# Altium schematic sheet V_9.SchDoc
size A4
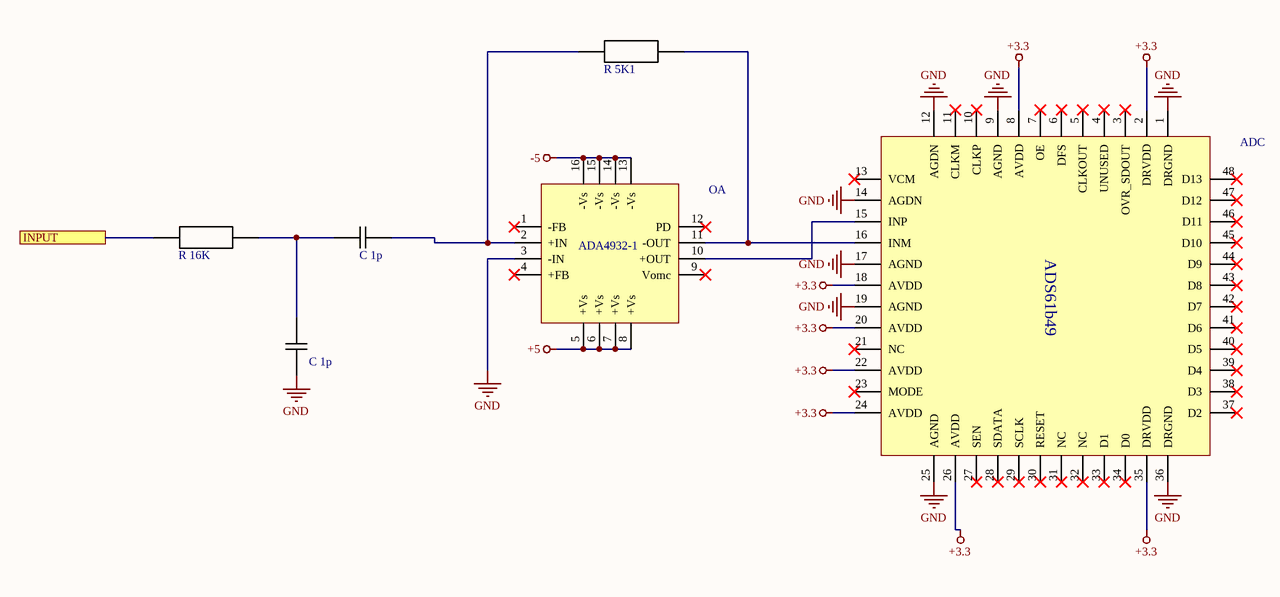
[diagram p0: V_9.SchDoc]

## Parts
1  ADC  [ADS61B49]
2  OA  [ADA4932-1]
3  R 16K  [R0805]
4  C 1p  [С0805]
8  C 1p  [С0805]
9  R 5K1  [R0805]

## Ports
INPUT

## Nets
+3.3: 1.2(DRVDD) 1.8(AVDD) 1.18(AVDD) 1.20(AVDD) 1.22(AVDD) 1.24(AVDD) 1.26(AVDD) 1.35(DRVDD)
+5: 2.5(+Vs) 2.6(+Vs) 2.7(+Vs) 2.8(+Vs)
-5: 2.13(-Vs) 2.14(-Vs) 2.15(-Vs) 2.16(-Vs)
GND: 1.1(DRGND) 1.9(AGND) 1.12(AGDN) 1.14(AGDN) 1.17(AGND) 1.19(AGND) 1.25(AGND) 1.36(DRGND) 2.3(-IN) 8.1
INPUT: 3.1 ; port INPUT
Net1_15: 1.15(INP) 2.10(+OUT)
Net1_16: 1.16(INM) 2.11(-OUT) 9.2
Net2_2: 2.2(+IN) 4.2 9.1
Net3_2: 3.2 4.1 8.2

Not connected (* = marked no-connect by the designer): 1 3(OVR_SDOUT)* 4(UNUSED)* 5(CLKOUT)* 6(DFS)* 7(OE)* 10(CLKP)* 11(CLKM)* 13(VCM)* 21(NC)* 23(MODE)* 27(SEN)* 28(SDATA)* 29(SCLK)* 30(RESET)* 31(NC)* 32(NC)* 33(D1)* 34(D0)* 37(D2)* 38(D3)* 39(D4)* 40(D5)* 41(D6)* 42(D7)* 43(D8)* 44(D9)* 45(D10)* 46(D11)* 47(D12)* 48(D13)*; 2 1(-FB)* 4(+FB)* 9(Vomc)* 12(PD)*

## Notes on the sheet
- (in symbol ADC) ADS61b49
- (in symbol OA) ADA4932-1

## Library data of the parts
3 = R: 16K
4 8 = C
9 = R